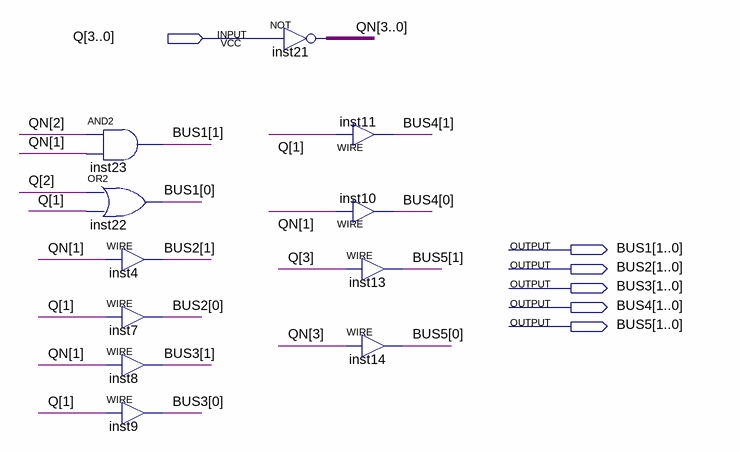
[diagram p0: schematic sheet]
// Quartus schematic BUS.bdf as structural Verilog: 11 symbols, 6 pins
module BUS (
  input  [3:0] Q,
  output [1:0] BUS1,
  output [1:0] BUS2,
  output [1:0] BUS3,
  output [1:0] BUS4,
  output [1:0] BUS5
);

  wire [3:0] QN;

  and inst23 (BUS1[1], QN[2], QN[1]);
  or inst22 (BUS1[0], Q[2], Q[1]);
  assign BUS2[1] = QN[1];  // WIRE inst4
  assign BUS2[0] = Q[1];  // WIRE inst7
  assign BUS3[1] = QN[1];  // WIRE inst8
  assign BUS3[0] = Q[1];  // WIRE inst9
  assign QN = ~Q;  // NOT inst21, 4 bits wide
  assign BUS4[1] = Q[1];  // WIRE inst11
  assign BUS4[0] = QN[1];  // WIRE inst10
  assign BUS5[1] = Q[3];  // WIRE inst13
  assign BUS5[0] = QN[3];  // WIRE inst14
endmodule
